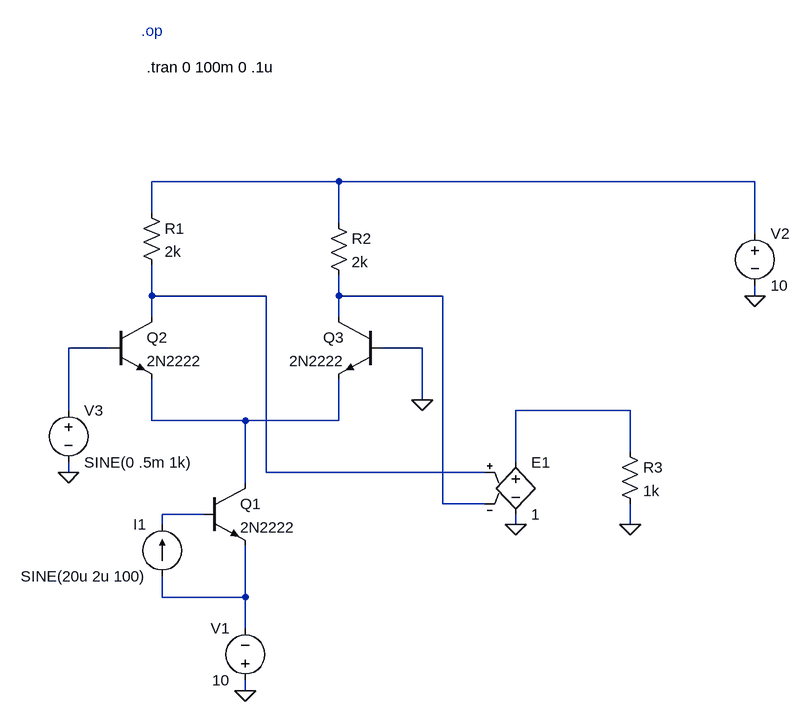
[diagram p0: schematic prueba1.asc]
prueba1.asc, the LTspice schematic file:
Version 4
SHEET 1 1080 680
WIRE 384 -288 96 -288
WIRE 1024 -288 384 -288
WIRE 96 -240 96 -288
WIRE 384 -224 384 -288
WIRE 1024 -208 1024 -288
WIRE 96 -112 96 -160
WIRE 272 -112 96 -112
WIRE 384 -112 384 -144
WIRE 544 -112 384 -112
WIRE 1024 -112 1024 -128
WIRE 96 -80 96 -112
WIRE 384 -80 384 -112
WIRE 32 -32 -32 -32
WIRE 512 -32 448 -32
WIRE 512 48 512 -32
WIRE -32 64 -32 -32
WIRE 832 64 656 64
WIRE 96 80 96 16
WIRE 240 80 96 80
WIRE 384 80 384 16
WIRE 384 80 240 80
WIRE 832 128 832 64
WIRE 656 144 656 64
WIRE -32 160 -32 144
WIRE 272 160 272 -112
WIRE 608 160 272 160
WIRE 240 176 240 80
WIRE 544 208 544 -112
WIRE 608 208 544 208
WIRE 176 224 112 224
WIRE 112 240 112 224
WIRE 656 240 656 224
WIRE 832 240 832 208
WIRE 112 352 112 320
WIRE 240 352 240 272
WIRE 240 352 112 352
WIRE 240 400 240 352
WIRE 240 496 240 480
FLAG 240 496 0
FLAG 1024 -112 0
FLAG 512 48 0
FLAG -32 160 0
FLAG 656 240 0
FLAG 832 240 0
SYMBOL npn 176 176 R0
SYMATTR InstName Q1
SYMATTR Value 2N2222
SYMBOL current 112 320 R180
WINDOW 0 24 80 Left 2
WINDOW 3 24 0 Left 2
WINDOW 123 0 0 Left 0
WINDOW 39 0 0 Left 0
SYMATTR InstName I1
SYMATTR Value SINE(20u 2u 100)
SYMBOL voltage 240 496 R180
WINDOW 0 24 96 Left 2
WINDOW 3 24 16 Left 2
WINDOW 123 0 0 Left 0
WINDOW 39 0 0 Left 0
SYMATTR InstName V1
SYMATTR Value 10
SYMBOL voltage 1024 -224 R0
WINDOW 123 0 0 Left 0
WINDOW 39 0 0 Left 0
SYMATTR InstName V2
SYMATTR Value 10
SYMBOL npn 32 -80 R0
SYMATTR InstName Q2
SYMATTR Value 2N2222
SYMBOL npn 448 -80 M0
SYMATTR InstName Q3
SYMATTR Value 2N2222
SYMBOL res 80 -256 R0
SYMATTR InstName R1
SYMATTR Value 2k
SYMBOL res 368 -240 R0
SYMATTR InstName R2
SYMATTR Value 2k
SYMBOL voltage -32 48 R0
WINDOW 123 0 0 Left 0
WINDOW 39 0 0 Left 0
SYMATTR InstName V3
SYMATTR Value SINE(0 .5m 1k)
SYMBOL e 656 128 R0
SYMATTR InstName E1
SYMATTR Value 1
SYMBOL res 816 112 R0
SYMATTR InstName R3
SYMATTR Value 1k
TEXT 80 -520 Left 2 ;.op
TEXT 88 -464 Left 2 !.tran 0 100m 0 .1u

The netlist it stands for:
* prueba1.asc
Q1 N006 N007 N008 0 2N2222
I1 N008 N007 SINE(20u 2u 100)
V1 0 N008 10
V2 N001 0 10
Q2 N002 N004 N006 0 2N2222
Q3 N003 0 N006 0 2N2222
R1 N001 N002 2k
R2 N001 N003 2k
V3 N004 0 SINE(0 .5m 1k)
E1 N005 0 N002 N003 1
R3 N005 0 1k
.model NPN NPN
.model PNP PNP
.lib standard.bjt
* .op
.tran 0 100m 0 .1u
.backanno
.end